# Altium schematic sheet Master.SchDoc
size A4
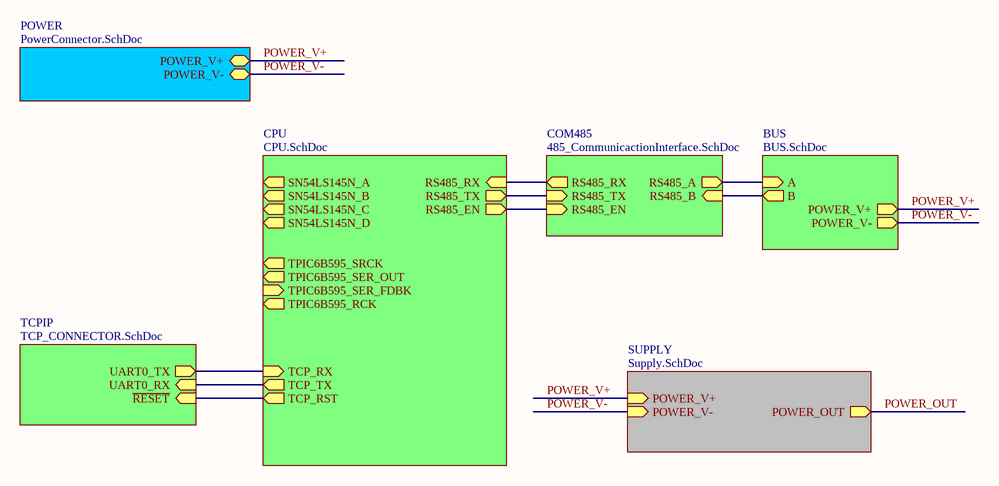
[diagram p0: Master.SchDoc]

## Sub-sheets
BUS = BUS.SchDoc: A (in), B (out), POWER_V+ (out), POWER_V- (out)
COM485 = 485_CommunicactionInterface.SchDoc: RS485_RX (out), RS485_TX (in), RS485_EN (in), RS485_A (out), RS485_B (in)
CPU = CPU.SchDoc: RS485_RX (in), RS485_TX (out), RS485_EN (out), TPIC6B595_SER_FDBK (in), TPIC6B595_SRCK (out), TPIC6B595_SER_OUT (out), TPIC6B595_RCK (out), SN54LS145N_A (out), SN54LS145N_B (out), SN54LS145N_C (out), SN54LS145N_D (out), TCP_RX (in), TCP_TX (out), TCP_RST (out)
POWER = PowerConnector.SchDoc: POWER_V+, POWER_V-
SUPPLY = Supply.SchDoc: POWER_V+ (in), POWER_V- (in), POWER_OUT (out)
TCPIP = TCP_CONNECTOR.SchDoc: UART0_RX (in), UART0_TX (out), ~{RESET} (in)

## Nets
POWER_OUT: sheet SUPPLY/POWER_OUT
POWER_V+: sheet BUS/POWER_V+, sheet SUPPLY/POWER_V+, sheet POWER/POWER_V+
POWER_V-: sheet BUS/POWER_V-, sheet SUPPLY/POWER_V-, sheet POWER/POWER_V-
(unnamed): sheet CPU/RS485_RX, sheet COM485/RS485_RX
(unnamed): sheet CPU/RS485_TX, sheet COM485/RS485_TX
(unnamed): sheet CPU/RS485_EN, sheet COM485/RS485_EN
(unnamed): sheet CPU/TCP_RX, sheet TCPIP/UART0_TX
(unnamed): sheet CPU/TCP_TX, sheet TCPIP/UART0_RX
(unnamed): sheet CPU/TCP_RST, sheet TCPIP/~{RESET}
(unnamed): sheet COM485/RS485_A, sheet BUS/A
(unnamed): sheet COM485/RS485_B, sheet BUS/B